# Altium schematic sheet 34.SchDoc
size A4
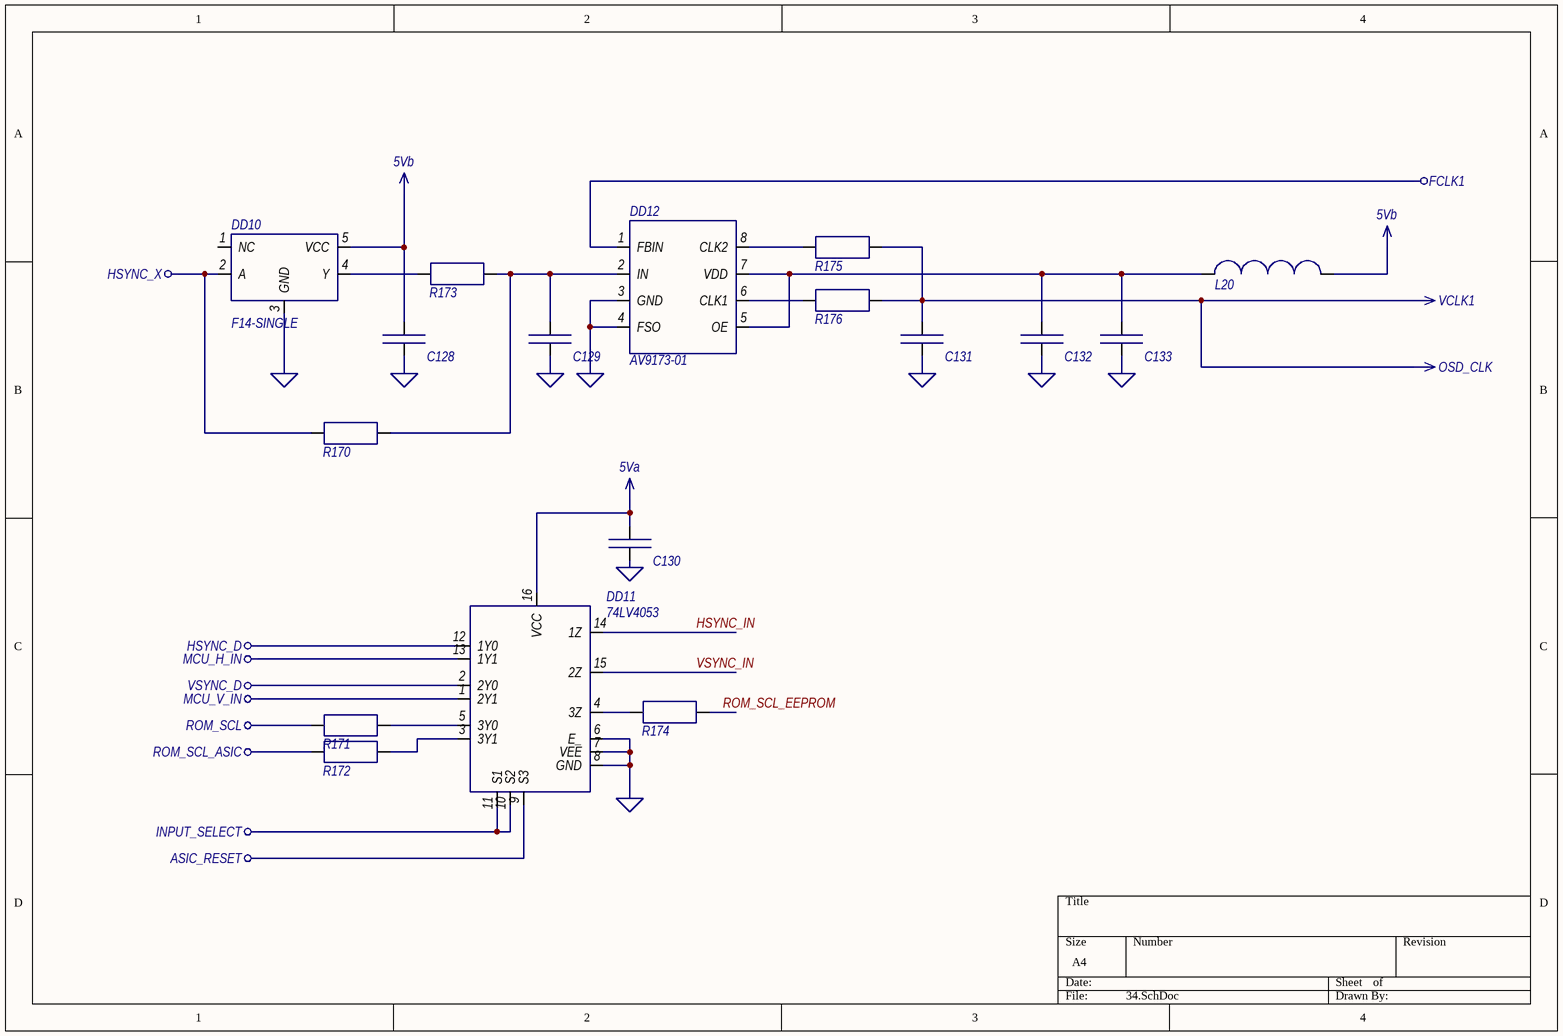
[diagram p0: 34.SchDoc]

## Parts
C128  Capacitor  [cap_electro_13]  (value not drawn)
C129  Capacitor  [cap_electro_13]  (value not drawn)
C130  Capacitor  [cap_electro_13]  (value not drawn)
C131  Capacitor  [cap_electro_13]  (value not drawn)
C132  Capacitor  [cap_electro_13]  (value not drawn)
C133  Capacitor  [cap_electro_13]  (value not drawn)
DD10  F14-SINGLE  [74AHC1G14(SOT25)]
DD11  74LV4053  [74LV4053(SOT38-4)]
DD12  AV9173-01  [AV9173-01(DIP8)]
L20  Inductor  [inductor]  (value not drawn)
R170  Resistor  [R_1206]  (value not drawn)
R171  Resistor  [R_1206]  (value not drawn)
R172  Resistor  [R_1206]  (value not drawn)
R173  Resistor  [R_1206]  (value not drawn)
R174  Resistor  [R_1206]  (value not drawn)
R175  Resistor  [R_1206]  (value not drawn)
R176  Resistor  [R_1206]  (value not drawn)

## Nets
5Va: C130.2 DD11.16(VCC)
5Vb: C128.1 DD10.5(VCC) L20.2
ASIC_RESET: DD11.9(S3)
FCLK1: DD12.1(FBIN)
GND: C128.2 C129.2 C130.1 C131.2 C132.2 C133.2 DD10.3(GND) DD11.6(E_) DD11.7(VEE) DD11.8(GND) DD12.3(GND) DD12.4(FSO)
HSYNC_D: DD11.12(1Y0)
HSYNC_X: DD10.2(A) R170.1
INPUT_SELECT: DD11.10(S2) DD11.11(S1)
MCU_H_IN: DD11.13(1Y1)
MCU_V_IN: DD11.1(2Y1)
OSD_CLK: C131.1 R175.2 R176.2  [also labelled VCLK1]
ROM_SCL: R171.1
ROM_SCL_ASIC: R172.1
VSYNC_D: DD11.2(2Y0)
HSYNC_IN: DD11.14(1Z)
ROM_SCL_EEPROM: R174.2
VSYNC_IN: DD11.15(2Z)
NetC129_1: C129.1 DD12.2(IN) R170.2 R173.2
NetC132_1: C132.1 C133.1 DD12.5(OE) DD12.7(VDD) L20.1
NetDD10_4: DD10.4(Y) R173.1
NetDD11_3: DD11.3(3Y1) R172.2
NetDD11_4: DD11.4(3Z) R174.1
NetDD11_5: DD11.5(3Y0) R171.2
NetDD12_6: DD12.6(CLK1) R176.1
NetDD12_8: DD12.8(CLK2) R175.1

Not connected (* = marked no-connect by the designer): DD10 1(NC)

## Library data of the parts
DD10 = 74AHC1G14-TA